# EAGLE design ControllerBoard (EAGLE 9.6.2)
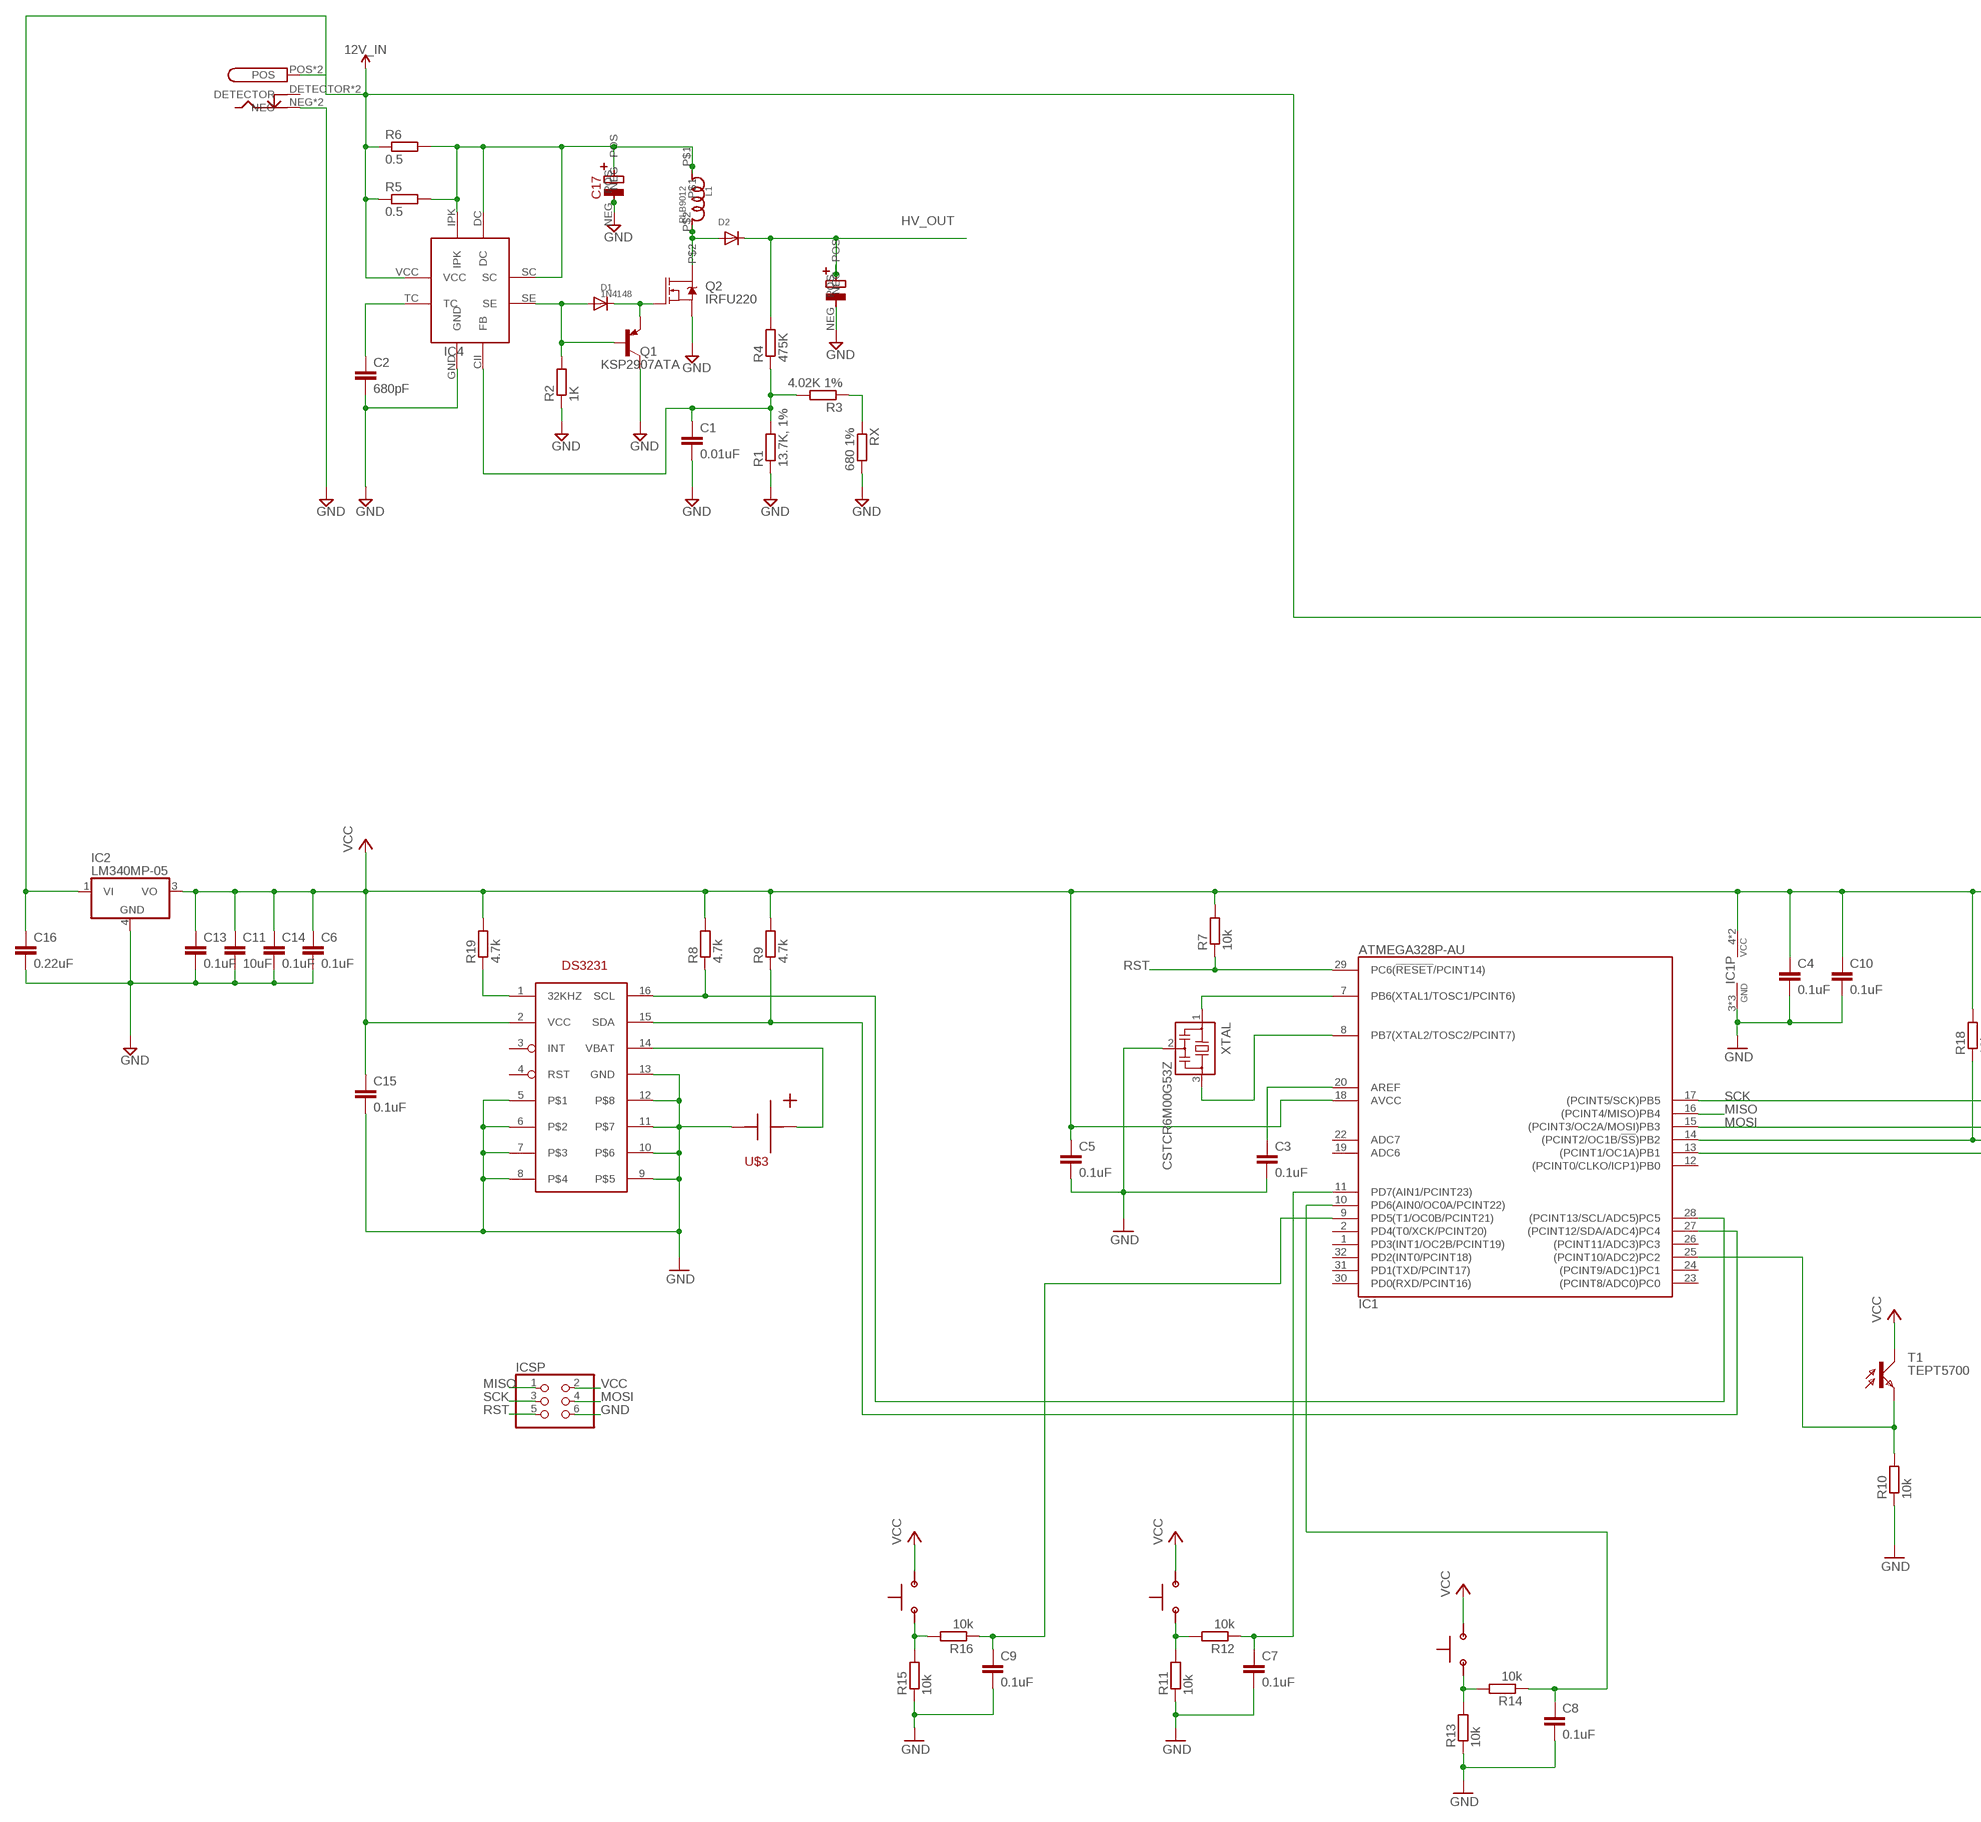
[diagram p0: schematic, sheet 1, part 1 of 2]
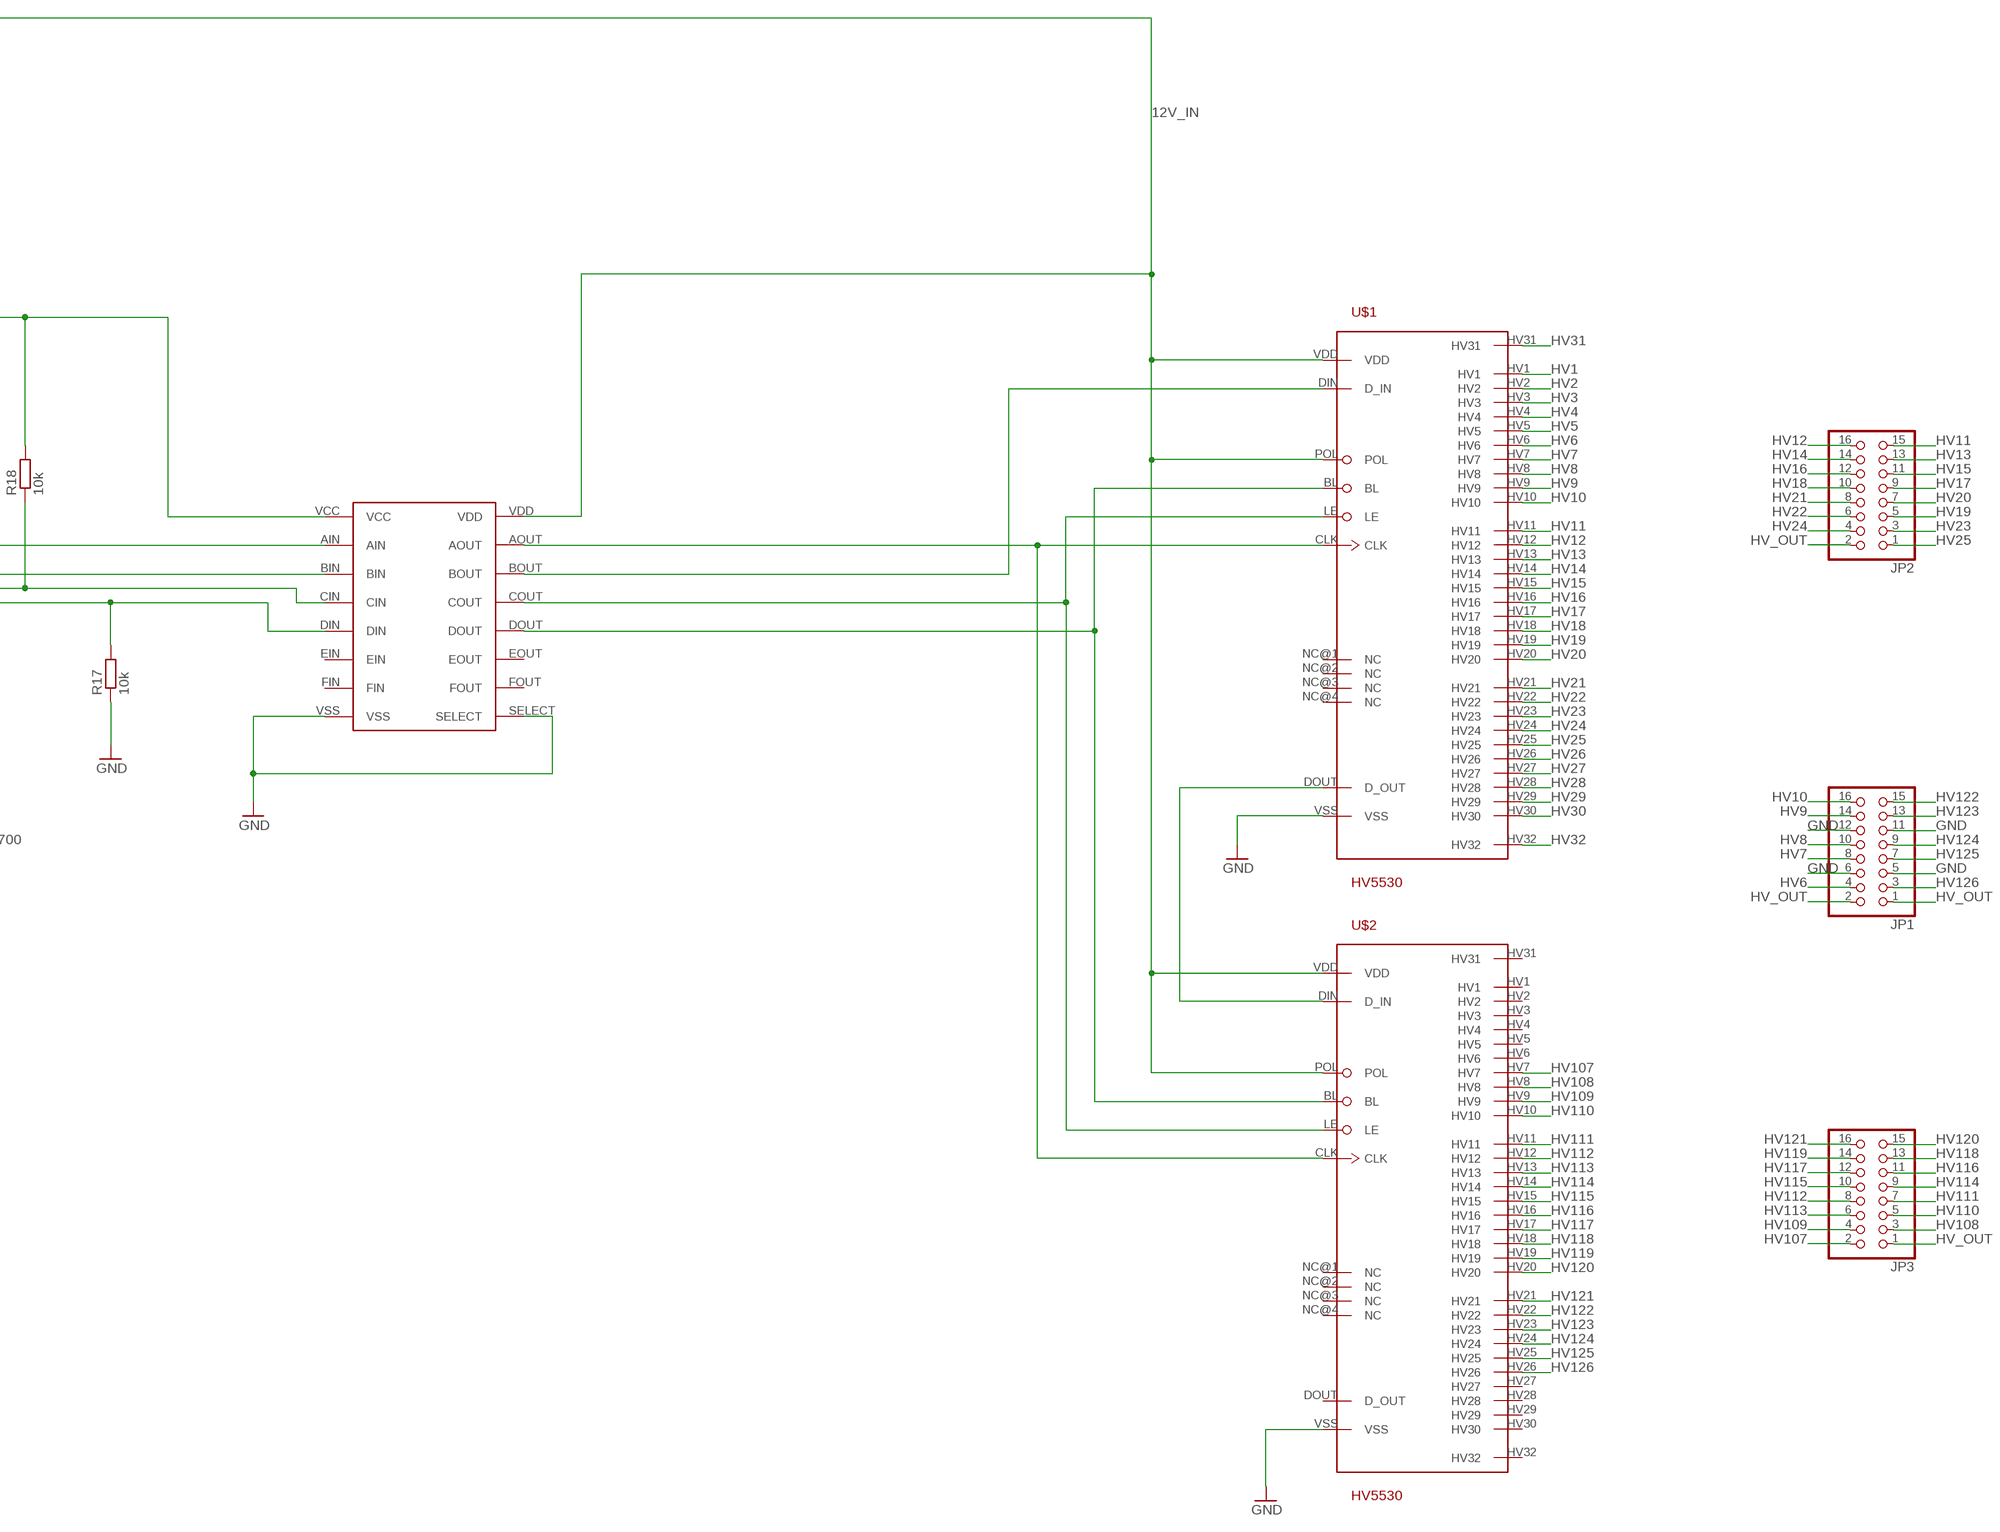
[diagram p1: schematic, sheet 1, part 2 of 2]

## Parts
12V  CUI_PWR_JACK  [CUI_PWR_JACK]
C1  0.01uF  C-EUC0603  [C0603]
C2  680pF  C-EUC0603  [C0603]
C3  0.1uF  C-EUC0603  [C0603]
C4  0.1uF  C-EUC0603  [C0603]
C5  0.1uF  C-EUC0603  [C0603]
C6  0.1uF  C-EUC0603  [C0603]
C7  0.1uF  C-EUC0603  [C0603]
C8  0.1uF  C-EUC0603  [C0603]
C9  0.1uF  C-EUC0603  [C0603]
C10  0.1uF  C-EUC0603  [C0603]
C11  10uF  C-EUC0603  [C0603]
C12  ECA-2DM3R3  [ECA-2DM3R3]
C13  0.1uF  C-EUC0603  [C0603]
C14  0.1uF  C-EUC0603  [C0603]
C15  0.1uF  C-EUC0603  [C0603]
C16  0.22uF  C-EUC0603  [C0603]
C17  EEU-FM1  [EEU-FM1]
D1  1N4148  DIODESOD-123  [SOD-123]
D2  DIODESOD-123  [SOD-123]
IC1  ATMEGA328P-AU  [QFP32_7X7_0.80]
IC2  LM340MP-05  [SOT223]
IC3  CD4504BTSSOP16  [SOP65P640X120-16N]
IC4  MC34063  MC34063ADR  [SOIC127P600X175-8]
ICSP  PINHD-2X3  [2X03]
JP1  PINHD-2X8  [2X08]
JP2  PINHD-2X8  [2X08]
JP3  PINHD-2X8  [2X08]
L1  RLB9012  [RLB9012]
Q1  KSP2907ATA  2N2907  [TO92-EBC-OVAL]
Q2  IRFU220  MOSFET-NCH-FQP30N06L  [TO220V]
R1  13.7K, 1%  R-EU_R1206  [R1206]
R2  1K  R-EU_R1206  [R1206]
R3  4.02K 1%  R-EU_R1206  [R1206]
R4  475K  R-EU_R1206  [R1206]
R5  0.5  R-EU_R1206  [R1206]
R6  0.5  R-EU_R1206  [R1206]
R7  10k  R-EU_R0603  [R0603]
R8  4.7k  R-EU_R0603  [R0603]
R9  4.7k  R-EU_R0603  [R0603]
R10  10k  R-EU_R0603  [R0603]
R11  10k  R-EU_R0603  [R0603]
R12  10k  R-EU_R0603  [R0603]
R13  10k  R-EU_R0603  [R0603]
R14  10k  R-EU_R0603  [R0603]
R15  10k  R-EU_R0603  [R0603]
R16  10k  R-EU_R0603  [R0603]
R17  10k  R-EU_R0603  [R0603]
R18  10k  R-EU_R0603  [R0603]
R19  4.7k  R-EU_R0603  [R0603]
RTC  DS3231  [SO16]
RX  680 1%  R-EU_R1206  [R1206]
S1  TL1105  [TL1105]
S2  TL1105  [TL1105]
S3  TL1105  [TL1105]
T1  TEPT5700  BPX81  [BPX81]
U$1  HV5530  [44_PQFP_CORRECTED]
U$2  HV5530  [44_PQFP_CORRECTED]
U$3  CR2032-SMD-HLDR  [CR2032-SMD]
XTAL  CSTCR6M00G53Z  [CSTCR6M]

## Nets
12V_IN: 12V.POS 12V.POS1(POS) C16.1 IC2.1(VI) IC3.VDD IC4.VCC R5.1 R6.1 U$1.POL U$1.VDD U$2.POL U$2.VDD
GND: 12V.NEG 12V.NEG1(NEG) C1.2 C2.2 C3.2 C4.2 C5.2 C6.2 C7.2 C8.2 C9.2 C10.2 C11.2 C12.NEG C13.2 C14.2 C15.2 C16.2 C17.NEG IC1.3(GND) IC1.5(GND) IC1.21(GND) IC2.4(GND) IC3.SELECT IC3.VSS IC4.GND ICSP.6 JP1.5 JP1.6 JP1.11 JP1.12 Q1.C Q2.3(S) R1.1 R2.1 R10.1 R11.1 R13.1 R15.1 R17.1 RTC.5 RTC.6 RTC.7 RTC.8 RTC.9 RTC.10 RTC.11 RTC.12 RTC.13(GND) RX.2 U$1.VSS U$2.VSS U$3.NEG XTAL.2
HV1: U$1.HV1
HV2: U$1.HV2
HV3: U$1.HV3
HV4: U$1.HV4
HV5: U$1.HV5
HV6: JP1.4 U$1.HV6
HV7: JP1.8 U$1.HV7
HV8: JP1.10 U$1.HV8
HV9: JP1.14 U$1.HV9
HV10: JP1.16 U$1.HV10
HV11: JP2.15 U$1.HV11
HV12: JP2.16 U$1.HV12
HV13: JP2.13 U$1.HV13
HV14: JP2.14 U$1.HV14
HV15: JP2.11 U$1.HV15
HV16: JP2.12 U$1.HV16
HV17: JP2.9 U$1.HV17
HV18: JP2.10 U$1.HV18
HV19: JP2.5 U$1.HV19
HV20: JP2.7 U$1.HV20
HV21: JP2.8 U$1.HV21
HV22: JP2.6 U$1.HV22
HV23: JP2.3 U$1.HV23
HV24: JP2.4 U$1.HV24
HV25: JP2.1 U$1.HV25
HV26: U$1.HV26
HV27: U$1.HV27
HV28: U$1.HV28
HV29: U$1.HV29
HV30: U$1.HV30
HV31: U$1.HV31
HV32: U$1.HV32
HV107: JP3.2 U$2.HV7
HV108: JP3.3 U$2.HV8
HV109: JP3.4 U$2.HV9
HV110: JP3.5 U$2.HV10
HV111: JP3.7 U$2.HV11
HV112: JP3.8 U$2.HV12
HV113: JP3.6 U$2.HV13
HV114: JP3.9 U$2.HV14
HV115: JP3.10 U$2.HV15
HV116: JP3.11 U$2.HV16
HV117: JP3.12 U$2.HV17
HV118: JP3.13 U$2.HV18
HV119: JP3.14 U$2.HV19
HV120: JP3.15 U$2.HV20
HV121: JP3.16 U$2.HV21
HV122: JP1.15 U$2.HV22
HV123: JP1.13 U$2.HV23
HV124: JP1.9 U$2.HV24
HV125: JP1.7 U$2.HV25
HV126: JP1.3 U$2.HV26
HV_OUT [wide keepout]: C12.POS D2.C JP1.1 JP1.2 JP2.2 JP3.1 R4.2
MISO: IC1.16((PCINT4/MISO)PB4) ICSP.1
MOSI: IC1.15((PCINT3/OC2A/MOSI)PB3) IC3.BIN ICSP.4
N$1: RTC.14(VBAT) U$3.POS@1(POS) U$3.POS@2(POS)
N$2: IC1.7(PB6(XTAL1/TOSC1/PCINT6)) XTAL.1
N$3: IC1.8(PB7(XTAL2/TOSC2/PCINT7)) XTAL.3
N$4: R19.1 RTC.1(32KHZ)
N$5: IC3.AOUT U$1.CLK U$2.CLK
N$6: U$1.DOUT(D_OUT) U$2.DIN(D_IN)
N$7: IC3.BOUT U$1.DIN(D_IN)
N$8: C17.POS IC4.DC IC4.IPK IC4.SC L1.P$1 R5.2 R6.2
N$9: C2.1 IC4.TC
N$10: D1.A IC4.SE Q1.B R2.2
N$11: D1.C Q1.E Q2.1(G)
N$12 [wide keepout]: D2.A L1.P$2 Q2.2(D)
N$13: C1.1 IC4.CII(FB) R1.2 R3.2 R4.1
N$14: IC1.14((PCINT2/OC1B/!SS!)PB2) IC3.CIN R18.1
N$15: IC1.13((PCINT1/OC1A)PB1) IC3.DIN R17.2
N$16: IC3.COUT U$1.LE U$2.LE
N$17: IC3.DOUT U$1.BL U$2.BL
N$18: C3.1 IC1.20(AREF)
N$19: IC1.25((PCINT10/ADC2)PC2) R10.2 T1.E
N$20: R3.1 RX.1
N$21: R13.2 R14.2 S2.1 S2.2
N$22: R11.2 R12.2 S1.1 S1.2
N$23: C8.1 IC1.10(PD6(AIN0/OC0A/PCINT22)) R14.1
N$24: C7.1 IC1.11(PD7(AIN1/PCINT23)) R12.1
N$25: R15.2 R16.2 S3.1 S3.2
N$26: C9.1 IC1.9(PD5(T1/OC0B/PCINT21)) R16.1
RST: IC1.29(PC6(!RESET!/PCINT14)) ICSP.5 R7.1
SCK: IC1.17((PCINT5/SCK)PB5) IC3.AIN ICSP.3
SCL: IC1.28((PCINT13/SCL/ADC5)PC5) R8.1 RTC.16(SCL)
SDA: IC1.27((PCINT12/SDA/ADC4)PC4) R9.1 RTC.15(SDA)
VCC: C4.1 C5.1 C6.1 C10.1 C11.1 C13.1 C14.1 C15.1 IC1.4(VCC) IC1.6(VCC) IC1.18(AVCC) IC2.3(VO) IC3.VCC ICSP.2 R7.2 R8.2 R9.2 R18.2 R19.2 RTC.2(VCC) S1.3 S1.4 S2.3 S2.4 S3.3 S3.4 T1.C
Unconnected: 12V.DETECTOR 12V.DETECTOR1(DETECTOR) IC1.1(PD3(INT1/OC2B/PCINT19)) IC1.2(PD4(T0/XCK/PCINT20)) IC1.12((PCINT0/CLKO/ICP1)PB0) IC1.19(ADC6) IC1.22(ADC7) IC1.23((PCINT8/ADC0)PC0) IC1.24((PCINT9/ADC1)PC1) IC1.26((PCINT11/ADC3)PC3) IC1.30(PD0(RXD/PCINT16)) IC1.31(PD1(TXD/PCINT17)) IC1.32(PD2(INT0/PCINT18)) IC3.EIN IC3.EOUT IC3.FIN IC3.FOUT RTC.3(INT) RTC.4(RST) U$1.NC@1(NC) U$1.NC@2(NC) U$1.NC@3(NC) U$1.NC@4(NC) U$2.DOUT(D_OUT) U$2.HV1 U$2.HV2 U$2.HV3 U$2.HV4 U$2.HV5 U$2.HV6 U$2.HV27 U$2.HV28 U$2.HV29 U$2.HV30 U$2.HV31 U$2.HV32 U$2.NC@1(NC) U$2.NC@2(NC) U$2.NC@3(NC) U$2.NC@4(NC)

## Library data of the parts
12V = CUI_PWR_JACK:CUI_PWR_JACK
C1-C11 C13-C16 = rcl:C-EU: CAPACITOR, European symbol; SPICEPREFIX: C
C12 = HCAPS:ECA-2DM3R3
C17 = HCAPS:EEU-FM1
D1 D2 = adafruit:DIODE: Diode SMADIODE - SMA Surface Mount Package 20V 1A Schottky Diode Digikey: 641-1014-6-ND DO-1N4148 - Through Hole Small Current Diode SOD-123 20V 1 A (.5mV Vf) Schottky Diode - Digikey: MBRX120TPMSCT-ND SOD-323 10V 570mA (.38mV Vf, 3ns) Schottky Diode - Digikey: ZLLS410CT-ND SOD-523 30V 30mA Schottky Diode (RB751S-40TE61) - Digikey: RB751S-40TE61CT-ND SOT23-R/W - SOT23 Package (R = Solder Paste/Reflow Ovens, W = Hand-Soldering) BAT54Film 40V 300mA - Digikey: 497-7162-1-ND
IC1 = atmel:ATMEGA*8: 8-bit AVR Microcontroller 4/8/16/32 kbytes flash 512/1k/1k/2k bytes SRAM 256/512/512/1k bytes EEPROM USART, 6/8-channel 10 bit ADC Pin compatible with Atmega8(L,A) Note: ADC6 and ADC7 are not available in 28-lead packages
IC2 = linear:LM340?-*: Positive VOLTAGE REGULATOR Source: http://cache.national.com/ds/LM/LM340.pdf
IC3 = CD4504B:CD4504B
IC4 = NixiePSU-Lib:MC34063
ICSP = pinhead:PINHD-2X3: PIN HEADER
JP1-JP3 = pinhead:PINHD-2X8: PIN HEADER
L1 = RLB9012:RLB9012
Q1 = adafruit:2N2907*: PNP Transistor Big Oval pads
Q2 = SparkFun-DiscreteSemi:MOSFET-NCH: N-channel MOSFETs Voltage controlled devices that allow control of high current outputs. SparkFun Products: SparkFun OpenScale <https://www.sparkfun.com/products/13261> SparkFun Digital Sandbox <https://www.sparkfun.com/products/12651> SparkFun Monster Moto Shield <https://www.sparkfun.com/products/10182> SparkFun MOSFET Power Controller <https://www.sparkfun.com/products/11214>; PROD_ID: TRANS-10060; VALUE: 60V/32A/35mΩ
R1-R19 RX = rcl:R-EU_: RESISTOR, European symbol; SPICEPREFIX: R
RTC = DS3231:DS3231
S1-S3 = TL1105:TL1105
T1 = opto-trans-siemens:BPX81: PHOTO TRANSISTOR; OC_FARNELL: unknown; OC_NEWARK: unknown
U$1 U$2 = HV5530:HV5530
U$3 = CR2032:CR2032-SMD-HLDR
XTAL = murata-filter:CSTCR: Resonator Source: murata.co.jp; MPN: CSTCR6M00G53-R0; OC_FARNELL: 1170434; OC_NEWARK: 25M8759

## Net classes
1 wide keepout: clearance 1.016 mm

## Board
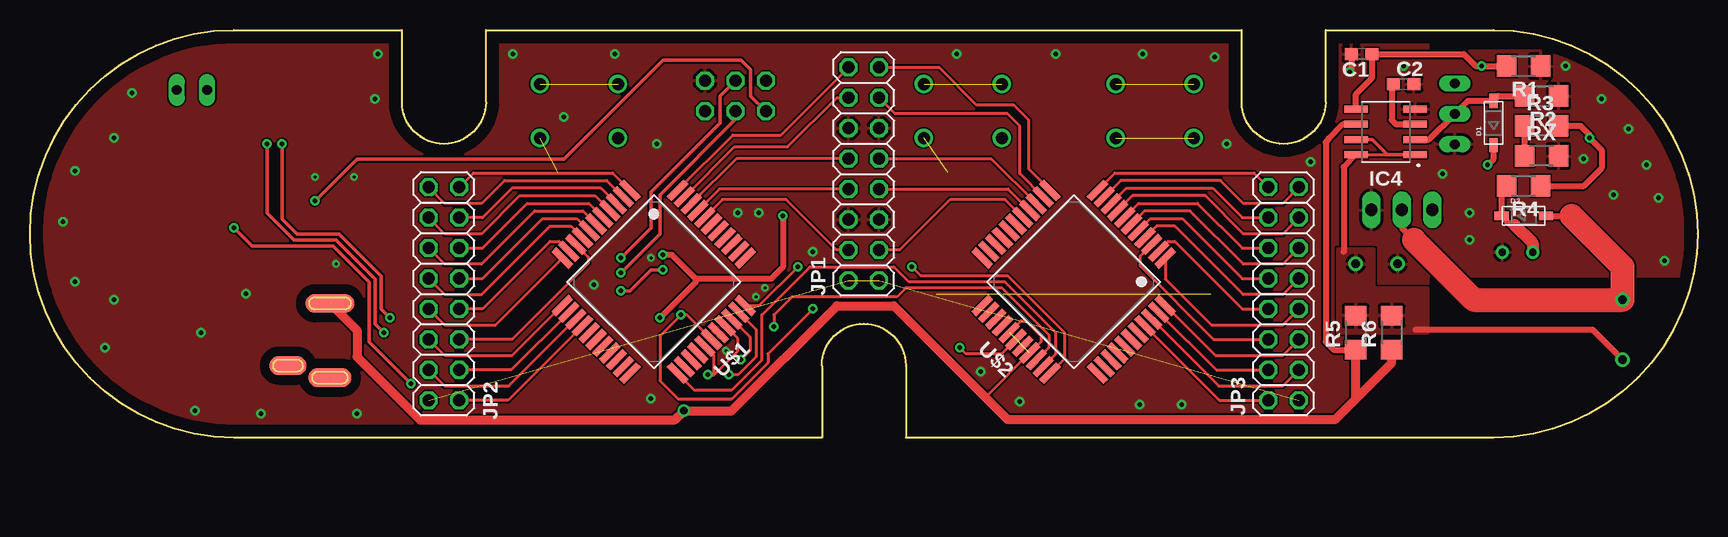
[diagram p2: board, top side]
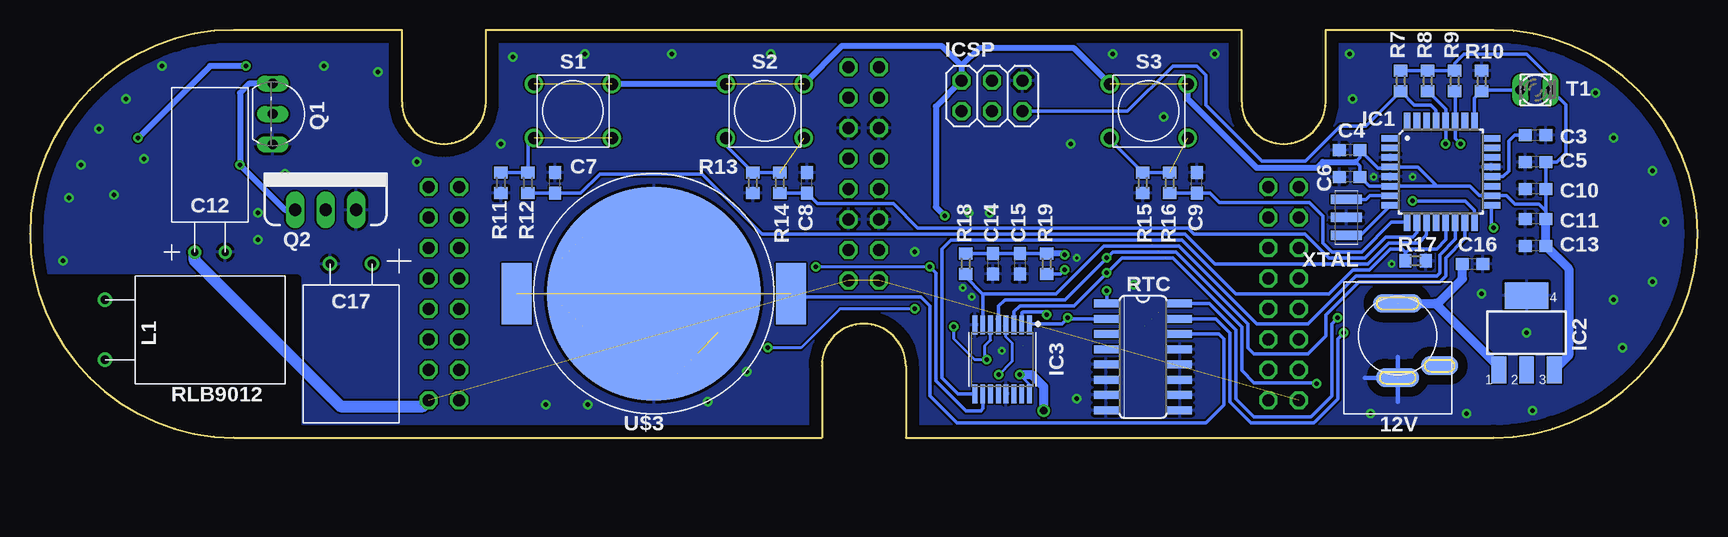
[diagram p3: board, bottom side, seen from below]

Size 139 x 34 mm. Coordinates in mm from the lower left corner, seen from the top.
Outline: 122,34 arc-180 122,0 73,0 73,6 arc180 66,6 66,0 17,0 arc-180 17,34 31,34 31,28 arc180 38,28 38,34 101,34 101,28 arc180 108,28 108,34 122,34
Copper layers (1*16): Top 0.035mm / dielectric 1.5mm / Bottom 0.035mm
Design rules "default *": minimum track width 6mil, minimum drill 0.2mm, track to track 6mil, track to pad 6mil, pad to pad 6mil, via to via 6mil, smd to smd 6mil, copper to edge 40mil, drill to drill 6mil, minimum pad ring 10mil, minimum via ring 8mil, stop-mask expansion 4mil, vias tented up to drill 0mil, thermal gap 10mil
bRestrict: area 116.8,-0.5 to 139.5,13.2

### Footprints (pad centres in the part's own frame; a part is rotated, then mirrored left to right if it is on the bottom)
CUI_PWR_JACK = smd 3.048 x 1.524: DETECTOR 3.5,-2.5 | smd 3.048 x 1.524 bottom: DETECTOR1 3.5,-2.5 | smd 3.556 x 1.524: NEG 0,-3.5 | smd 3.556 x 1.524 bottom: NEG1 0,-3.5 | smd 4.064 x 1.524: POS 0,2.7 | smd 4.064 x 1.524 bottom: POS1 0,2.7
C0603 = smd 1.1 x 1: 1 -0.85,0; 2 0.85,0
ECA-2DM3R3 = drill 0.6: NEG -2.54,-1.27; POS -2.54,1.27
EEU-FM1 = drill 0.7: NEG -1.75,-1.75; POS -1.75,1.75
SOD-123 = smd 1.2 x 0.7: A 1.85,0; C -1.85,0
QFP32_7X7_0.80 = smd 1.5 x 0.55: 1 -4.2,2.8; 2 -4.2,2; 3 -4.2,1.2; 4 -4.2,0.4; 5 -4.2,-0.4; 6 -4.2,-1.2; 7 -4.2,-2; 8 -4.2,-2.8; 17 4.2,-2.8; 18 4.2,-2; 19 4.2,-1.2; 20 4.2,-0.4; 21 4.2,0.4; 22 4.2,1.2; 23 4.2,2; 24 4.2,2.8 | smd 0.55 x 1.5: 9 -2.8,-4.2; 10 -2,-4.2; 11 -1.2,-4.2; 12 -0.4,-4.2; 13 0.4,-4.2; 14 1.2,-4.2; 15 2,-4.2; 16 2.8,-4.2; 25 2.8,4.2; 26 2,4.2; 27 1.2,4.2; 28 0.4,4.2; 29 -0.4,4.2; 30 -1.2,4.2; 31 -2,4.2; 32 -2.8,4.2
SOT223 = smd 1.219 x 2.235: 1 -2.311,-3.099; 2 0,-3.099; 3 2.311,-3.099 | smd 3.6 x 2.2: 4 0,3.099
SOP65P640X120-16N = smd 1.572 x 0.407: AIN -2.872,0.975; AOUT -2.872,1.625; BIN -2.872,-0.325; BOUT -2.872,0.325; CIN -2.872,-1.625; COUT -2.872,-0.975; DIN 2.872,-2.275; DOUT 2.872,-1.625; EIN 2.872,-0.975; EOUT 2.872,-0.325; FIN 2.872,0.975; FOUT 2.872,1.625; SELECT 2.872,0.325; VCC -2.872,2.275; VDD 2.872,2.275; VSS -2.872,-2.275
SOIC127P600X175-8 = smd 1.968 x 0.599: CII 2.473,-1.905; DC 2.473,1.905; GND -2.473,-1.905; IPK 2.473,0.635; SC -2.473,1.905; SE -2.473,0.635; TC -2.473,-0.635; VCC 2.473,-0.635
2X03 = drill 1.016 octagon: 1 -2.54,-1.27; 2 -2.54,1.27; 3 0,-1.27; 4 0,1.27; 5 2.54,-1.27; 6 2.54,1.27
2X08 = drill 1.016 octagon: 1 -8.89,-1.27; 2 -8.89,1.27; 3 -6.35,-1.27; 4 -6.35,1.27; 5 -3.81,-1.27; 6 -3.81,1.27; 7 -1.27,-1.27; 8 -1.27,1.27; 9 1.27,-1.27; 10 1.27,1.27; 11 3.81,-1.27; 12 3.81,1.27; 13 6.35,-1.27; 14 6.35,1.27; 15 8.89,-1.27; 16 8.89,1.27
RLB9012 = drill 0.7: P$1 -2.5,-2.5; P$2 -2.5,2.5
TO92-EBC-OVAL = drill 0.813 long: B 0,-1.27; C 2.54,-1.27; E -2.54,-1.27
TO220V = drill 1.016 long: 1 -2.54,0; 2 0,0; 3 2.54,0
R1206 = smd 1.6 x 1.803: 1 -1.422,0; 2 1.422,0
R0603 = smd 1 x 1.1: 1 -0.85,0; 2 0.85,0
SO16 = smd 0.66 x 2.032: 1 -4.445,-3.073; 2 -3.175,-3.073; 3 -1.905,-3.073; 4 -0.635,-3.073; 5 0.635,-3.073; 6 1.905,-3.073; 7 3.175,-3.073; 8 4.445,-3.073; 9 4.445,3.073; 10 3.175,3.073; 11 1.905,3.073; 12 0.635,3.073; 13 -0.635,3.073; 14 -1.905,3.073; 15 -3.175,3.073; 16 -4.445,3.073
TL1105 = drill 1: 1 0,0; 2 6.5,0; 3 0,4.5; 4 6.5,4.5
BPX81 = drill 0.813 long: C 1.27,0; E -1.27,0
44_PQFP_CORRECTED = smd 0.55 x 2: BL -4,6.8; CLK 0,6.8; DIN -3.2,6.8; DOUT 4,6.8; HV11 -4,-6.8; HV12 -3.2,-6.8; HV13 -2.4,-6.8; HV14 -1.6,-6.8; HV15 -0.8,-6.8; HV16 0,-6.8; HV17 0.8,-6.8; HV18 1.6,-6.8; HV19 2.4,-6.8; HV20 3.2,-6.8; HV21 4,-6.8; LE -2.4,6.8; NC@1 3.2,6.8; NC@2 2.4,6.8; NC@3 1.6,6.8; POL 0.8,6.8; VDD -1.6,6.8; VSS -0.8,6.8 | smd 2 x 0.55: HV1 -6.8,3.2; HV2 -6.8,2.4; HV3 -6.8,1.6; HV4 -6.8,0.8; HV5 -6.8,0; HV6 -6.8,-0.8; HV7 -6.8,-1.6; HV8 -6.8,-2.4; HV9 -6.8,-3.2; HV10 -6.8,-4; HV22 6.8,-4; HV23 6.8,-3.2; HV24 6.8,-2.4; HV25 6.8,-1.6; HV26 6.8,-0.8; HV27 6.8,0; HV28 6.8,0.8; HV29 6.8,1.6; HV30 6.8,2.4; HV31 6.8,3.2; HV32 6.8,4; NC@4 -6.8,4
CR2032-SMD = smd 17.8 x 17.8: NEG 0,0 | smd 2.5 x 5.1: POS@1 -11.45,0; POS@2 11.45,0
CSTCR6M = smd 0.8 x 2.6: 1 -1.5,0; 2 0,0; 3 1.5,0

### Placement (x,y rotation side)
12V  25,8.5 0 bottom
C1  111,32 180 top
C2  114.5,29.5 0 top
C3  13.5,25.25 0 bottom
C4  29,24 180 bottom
C5  13.5,23 180 bottom
C6  29,21.75 180 bottom
C7  95.25,21.25 90 bottom
C8  74.25,21.25 90 bottom
C9  41.75,21.25 90 bottom
C10  13.5,20.75 180 bottom
C11  13.5,18.25 180 bottom
C12  124,18 90 bottom
C13  13.5,16 180 bottom
C14  58.75,14.5 270 bottom
C15  56.5,14.5 270 bottom
C16  18.75,14.5 0 bottom
C17  112.25,12.75 270 bottom
D1  122,26.25 90 top
D2  124.5,18.5 0 top
IC1  21.4,22.18 0 bottom
IC2  14.25,8.75 0 bottom
IC3  57.96,6.52 270 bottom
IC4  113,25.5 180 top
ICSP  58.81,28.5 0 bottom
JP1  69.5,22 90 top
JP2  34.5,12 90 top
JP3  104.5,12 90 top
L1  130.25,9 0 bottom
Q1  117.5,27 270 bottom
Q2  114.36,18.99 0 bottom
R1  124.5,31 180 top
R2  126,28.5 180 top
R3  126,26 0 top
R4  124.5,21 180 top
R5  110.5,8.75 90 top
R6  113.5,8.75 90 top
R7  24.75,29.75 90 bottom
R8  22.5,29.75 90 bottom
R9  20.25,29.75 90 bottom
R10  18,29.75 270 bottom
R11  99.75,21.25 90 bottom
R12  97.5,21.25 90 bottom
R13  78.75,21.25 90 bottom
R14  76.5,21.25 90 bottom
R15  46.25,21.25 90 bottom
R16  44,21.25 90 bottom
R17  23.5,14.75 180 bottom
R18  61,14.5 90 bottom
R19  54.25,14.5 90 bottom
RTC  46.23,6.72 270 bottom
RX  126,23.5 0 top
S1  97,25 0 bottom
S2  81,25 0 bottom
S3  49,25 0 bottom
T1  13.5,29 0 bottom
U$1  52,13 225 top
U$2  87,13 135 top
U$3  87,12 0 bottom
XTAL  29.27,18.36 270 bottom

### Tracks (layer width: path | path; a pad name or v marks a point on that pad's centre or on a via)
12V_IN  (via drill 0.35, 0.6)  (5 unrouted)
  Top 0.254: v56.5,5.25 57,5.25 | 57,5.25 57,6.87 U$1.POL | 57,5.25 59,7.25 59,8.26 U$1.VDD | 79.62,3.38 79.64,3.38 U$2.VDD 84.25,7.99 84.25,8.5 83,9.75 82.62,9.75 U$2.POL
  Top 0.508: IC4.VCC 109.45,26.14 108.26,24.94 108,24.63 108,8 108.67,7.33 R5.1
  Top 0.762: 12V.POS1 27.25,8.95 27.25,6.75 32.53,1.47 53.72,1.47 v54.5,2.25 54.53,2.22 58.47,2.22 67.25,11 72,11 79.62,3.38 81.5,1.5 108.75,1.5 110.5,3.25 | 110.5,3.25 R5.1 | 110.5,3.25 113.5,6.25 R6.1
  Bottom 0.254: IC3.VDD 55.68,4.43 v56.5,5.25
  Bottom 0.762: 12V.POS1 21.86,11.2 | 21.86,11.2 21.65,11.2 19.6,13.25 C16.1 | 21.86,11.2 16.56,5.9 IC2.1 | v54.5,2.25 54.5,4.25 55.5,5.25 v56.5,5.25
GND  (via drill 0.25, 0.35)  (1 unrouted)
  Top 0.508: C1.2 110.15,30.65 v110,30.5
  Bottom 0.381: 12V.NEG1 25,6.75 | 12V.NEG1 25,3 | 27.75,5 12V.NEG1
  other vias: 114.5,31 128,31 131,28.25 129.5,23.25 79.25,5.5 58,7.25 60.5,11.75 61.25,12.5 23.75,21.75 27,21.75 51.75,3.25 47,12.75 59,18.75 60.75,18.75 51.75,15 25.5,14.5 7,25 7,11.5 14.25,8.75 18,12 52.25,24.5 65.25,15.5 133.25,25.75 134.75,22.75 135.75,20 136.25,14.75 106.75,23 99.75,24.5 98.75,31.75 92.75,32 85.5,32 77.25,32 48.75,32 40.25,32 29,32 28.75,28.25 44.5,26.75 8.5,28.75 3.75,22.25 2.75,18 3.75,13 6.25,7.5 13.75,2.25 19.25,2 27.25,2 82.5,3 92.5,2.75 96,2.75 132,20.25 120,16.5 120,18.75 117.75,22
  pour Bottom: 0,34 0,0 139,0 139,34
  pour Top: 137.75,32.25 112.5,32.25 112.5,22.5 109.5,22.5 109.5,16.75 113,16.75 113,13.5 137.75,13.5
  pour Top (rank 2): 0.25,33.25 116.5,33.25 116.5,0.75 0,0.75
HV6
  Top 0.254: JP1.4 67.25,15.65 63.04,19.86 57.73,19.86 U$1.HV6
HV7
  Top 0.254: JP1.8 57.47,20.73 U$1.HV7
HV8
  Top 0.254: JP1.10 58.88,23.27 U$1.HV8
HV9
  Top 0.254: U$1.HV9 58.74,24.26 63.16,24.26 67.25,28.35 JP1.14
HV10
  Top 0.254: U$1.HV10 58.59,25.25 62.61,25.25 68.23,30.87 JP1.16
HV11
  Top 0.254: JP2.15 36.96,22.08 48.58,22.08 U$1.HV11
HV12
  Top 0.254: U$1.HV12 48.08,21.45 39.54,21.45 37.64,19.54 34.58,19.54 JP2.16
HV13
  Top 0.254: U$1.HV13 47.58,20.81 40.18,20.81 37.72,18.35 JP2.13
HV14
  Top 0.254: U$1.HV14 47.09,20.18 40.81,20.18 37.64,17 34.58,17 JP2.14
HV15
  Top 0.254: JP2.11 37.72,15.81 41.45,19.54 46.59,19.54 U$1.HV15
HV16
  Top 0.254: U$1.HV16 46.09,18.91 42.08,18.91 37.64,14.46 34.58,14.46 JP2.12
HV17
  Top 0.254: JP2.9 37.72,13.27 42.72,18.27 45.6,18.27 U$1.HV17
HV18  (1 unrouted)
  Top 0.254: JP2.10 34.58,11.92 37.64,11.92 43.35,17.64 45.1,17.64 U$1.HV18
HV19  (1 unrouted)
  Top 0.254: U$1.HV19 46.53,15.08 46.53,14.53 40.19,8.19 JP2.5
HV20  (1 unrouted)
  Top 0.254: U$1.HV20 44.11,16.36 43.35,16.36 37.72,10.73 JP2.7
HV21  (1 unrouted)
  Top 0.254: U$1.HV21 44.36,14.94 38.79,9.37 34.59,9.37 JP2.8
HV22  (1 unrouted)
  Top 0.254: JP2.6 34.58,6.84 40.18,6.84 U$1.HV22
HV23  (1 unrouted)
  Top 0.254: JP2.3 40.12,5.65 U$1.HV23
HV24  (1 unrouted)
  Top 0.254: JP2.4 34.58,4.3 39.91,4.3 U$1.HV24
HV25  (1 unrouted)
  Top 0.254: U$1.HV25 39.85,3.11 JP2.1
HV107  (1 unrouted)
  Top 0.254: U$2.HV7 99.15,3.11 JP3.2
HV108  (1 unrouted)
  Top 0.254: U$2.HV8 99.09,4.3 104.42,4.3 JP3.3
HV109  (1 unrouted)
  Top 0.254: U$2.HV9 98.88,5.65 JP3.4
HV110  (1 unrouted)
  Top 0.254: U$2.HV10 98.82,6.84 104.42,6.84 JP3.5
HV111  (1 unrouted)
  Top 0.254: U$2.HV11 94.64,13.23 98.48,9.38 104.42,9.38 JP3.7
HV112  (1 unrouted)
  Top 0.254: U$2.HV12 94.89,16.36 95.42,16.36 101.06,10.73 JP3.8
HV113  (1 unrouted)
  Top 0.254: JP3.6 98.65,8.19 92.55,14.3 92.55,15.15 U$2.HV13
HV114  (1 unrouted)
  Top 0.254: JP3.9 104.42,11.92 101.14,11.92 95.42,17.64 93.9,17.64 U$2.HV14
HV115
  Top 0.254: U$2.HV15 93.4,18.27 96.06,18.27 101.06,13.27 JP3.10
HV116
  Top 0.254: JP3.11 104.42,14.46 101.14,14.46 96.69,18.91 92.91,18.91 U$2.HV16
HV117
  Top 0.254: U$2.HV17 92.41,19.54 97.33,19.54 101.06,15.81 JP3.12
HV118
  Top 0.254: JP3.13 104.42,17 101.14,17 97.96,20.18 91.91,20.18 U$2.HV18
HV119
  Top 0.254: U$2.HV19 91.42,20.81 98.6,20.81 101.06,18.35 JP3.14
HV120
  Top 0.254: JP3.15 104.42,19.54 101.14,19.54 99.23,21.45 90.92,21.45 U$2.HV20
HV121
  Top 0.254: U$2.HV21 90.42,22.08 102.04,22.08 JP3.16
HV122
  Top 0.254: JP1.15 75.77,30.89 78.91,27.75 82,27.75 83.25,26.5 83.25,22.41 U$2.HV22
HV123
  Top 0.254: JP1.13 72.11,27.01 81.49,27.01 82.51,25.99 82.51,22.01 U$2.HV23
HV124
  Top 0.254: JP1.9 80.12,23.27 U$2.HV24
HV125
  Top 0.254: JP1.7 81.53,20.73 U$2.HV25
HV126
  Top 0.254: U$2.HV26 81.27,19.86 76.69,19.86 72.48,15.65 JP1.3
HV_OUT  (3 unrouted)
  Top 0.508: R4.2 122.65,20.57 D2.C 123.4,17.75 123.73,17.75
  Top 1: 123.73,17.75 125.27,16.21 C12.POS
  Bottom 1: JP3.1 106.27,2.61 113.11,2.61 125.27,14.77 C12.POS
MISO  (via drill 0.35)
  Top 0.305: v23.75,19.75 27.25,23.25 44.5,23.25 52.75,31.5 59.25,31.5 60.08,30.67 60.08,28.5 ICSP.1
  Bottom 0.305: IC1.16 18.6,18.98 19.35,19.73 23.73,19.73 v23.75,19.75
MOSI  (via drill 0.35)
  Top 0.305: ICSP.4 57.5,28.46 57.5,26.25 51.75,20.5 51.75,17.5 v49.25,15
  Bottom 0.305: IC1.15 19.4,16.6 21,15 21,13.5 21.5,13 28.25,13 31,10.25 31,8.5 32.5,7 37,7 37.5,7.5 37.5,9.5 43.5,15.5 48.75,15.5 v49.25,15 52.75,11.5 57.75,11.5 58.28,10.97 IC3.BIN
N$1  (1 unrouted)
  Bottom 0.305: U$3.POS@2 75.3,11.75 64.75,11.75 64,11 64,3.5 61.74,1.25 41,1.25 39.5,2.75 39.5,8.25 39.88,8.63 RTC.14
N$2
  Bottom 0.305: XTAL.1 27.64,19.86 27.32,20.18 IC1.7
N$3
  Bottom 0.305: XTAL.3 28.11,16.86 IC1.8
N$4  (via drill 0.35)
  Top 0.305: v49.25,12.25 50,12.25 51.75,14 v52.75,14
  Bottom 0.305: RTC.1 49.25,11.22 v49.25,12.25 | R19.1 53.1,13.65 v52.75,14
N$5  (via drill 0.35)  (2 unrouted)
  Top 0.254: U$1.CLK 54.75,10.25 v54.25,10.25 52.5,8.5 52.5,4.75 54,3.25 58.5,3.25 61.5,6.25 61.5,7 v65.25,10.75 | U$2.CLK 81,7 78.25,7 78,7 v77.5,7.5
  Bottom 0.254: v65.25,10.75 71.5,10.75 74.75,7.5 v77.5,7.5
  Bottom 0.305: IC3.AOUT 56.33,10.42 56.25,10.5 54.5,10.5 v54.25,10.25
N$6  (2 unrouted)
  Top 0.254: U$1.DOUT 55.34,4 58.5,4 61,6.5 61,10.25 65,14.25 72,14.25 73.25,13 81.25,13 85.5,8.75 85.5,6.97 U$2.DIN
N$7  (via drill 0.35)  (1 unrouted)
  Top 0.254: U$1.DIN 60.5,9.03 60.5,6.75 59,5.25 v58.25,5.25
  Bottom 0.254: v58.25,5.25 57.13,6.37 57.13,7.89 57.63,8.39 IC3.BOUT
N$8
  Top 0.254: IC4.DC 113.25,23.59
  Top 0.305: IC4.IPK 111.89,24.86 113.16,23.59 113.25,23.59 IC4.SC
  Top 0.508: IC4.DC 109.5,22.57 109.5,15.5 | L1.P$1 130.25,9 115.5,9
  pour Top: 109,15.75 112,15.75 112,12.5 116.5,12.5 116.5,8.75 109,8.75
N$9
  Top 0.508: C2.1 113.5,29.35 113.5,26.5 113.86,26.14 IC4.TC
N$10
  Top 0.508: IC4.SE 116.61,24.86 118.75,27 Q1.B 119.87,28.1 D1.A 122.4,28.5 R2.2
N$11  (via drill 0.35)
  Top 0.508: v121.5,22.75 122,23.25 D1.C
  Bottom 0.508: Q1.E 120.71,29.54 121.5,28.75 v121.5,22.75 117.74,18.99 Q2.1
N$12
  Top 0.508: D2.A 128.5,18.5 | 115.36,16.49 114.36,17.49 Q2.2
  Top 2: 128.5,18.5 132.75,14.25 L1.P$2 120.36,11.5 115.36,16.49
N$13  (via drill 0.35)
  Top 0.508: IC4.CII 110.53,28.66 111.85,29.98 C1.1 119.5,32 120.5,31 v121,31 R1.2 | R4.1 129.5,21 131,22.5 131,24 v130,25 130,25.25 129.25,26 R3.2
  Bottom 0.508: v121,31 124,31 v130,25
N$14
  Bottom 0.305: IC1.14 20.2,16.55 21.5,15.25 21.5,13.75 21.75,13.5 28.5,13.5 32.5,9.5 36.75,9.5 43.25,16 49.5,16 53.5,12 59.58,12 | R18.1 61,13.4 59.6,12 59.58,12 | 59.58,12 IC3.CIN
N$15
  Bottom 0.305: IC1.13 21,16.5 21.75,15.75 24,15.75 24.35,15.4 R17.2 24.35,15.5 24.6,15.75 25.6,15.75 27.35,14 28.75,14 30.75,12 38.5,12 43,16.5 62.25,16.5 63,15.75 63,5 61.65,3.65 IC3.DIN
N$16  (via drill 0.35)  (2 unrouted)
  Top 0.254: U$1.LE 60,8.39 60,7.25 v59.25,6.5 | U$2.LE 84.96,7.57 84.96,8.54 81,12.5 73,12.5 72.25,11.75 63.5,11.75 62,10.25 v62,9.25
  Bottom 0.254: IC3.COUT 58.93,8.14 59.43,7.64 59.43,6.68 v59.25,6.5 60.25,6.5 62,8.25 v62,9.25
N$17  (via drill 0.35)  (2 unrouted)
  Top 0.254: U$1.BL 60.77,11.02 v64,14.25 | U$2.BL 86.25,6.59 86.25,8.75 81.5,13.5 74.25,13.5 v73.5,14.25
  Bottom 0.254: v64,14.25 v73.5,14.25
  Bottom 0.305: IC3.DOUT 59.58,2.42 59.75,2.25 61,2.25 63.5,4.75 63.5,13.75 v64,14.25
N$18
  Bottom 0.305: C3.1 15.25,25.25 15.75,24.75 15.75,22.25 16.23,21.77 IC1.20
N$19
  Bottom 0.305: T1.E 17.75,29 17.85,28.9 R10.2 18.6,28.3 IC1.25
N$20
  Top 0.508: R3.1 RX.1
N$21  (1 unrouted)
  Bottom 0.305: R14.2 R13.2 81,24.35 S2.1
N$22  (1 unrouted)
  Bottom 0.305: R11.2 R12.2 97.5,24.5 S1.1
N$23
  Bottom 0.305: R14.1 C8.1 73.36,19.51 67.04,19.51 65.03,17.5 42.5,17.5 42,17 32.75,17 30.75,15 27.75,15 26,16.75 23.75,16.75 23.4,17.1 IC1.10
N$24
  Bottom 0.305: R12.1 C7.1 93.1,20.4 91.5,22 83,22 78,17 42.75,17 40.25,14.5 27.5,14.5 25.75,16.25 23.25,16.25 22.6,16.9 IC1.11
N$25  (1 unrouted)
  Bottom 0.305: R16.2 R15.2 49,24.85 S3.1
N$26
  Bottom 0.305: R16.1 C9.1 40.65,20.4 39.88,19.62 32.38,19.62 31.25,18.5 31.25,16.25 30.5,15.5 28,15.5 25.52,17.98 IC1.9
RST
  Bottom 0.305: IC1.29 21.8,27.3 22.25,27.75 23.6,27.75 R7.1 27.65,26 29.76,26 32.71,23.06 36.31,23.06 41,27.75 41,30.25 41.75,31 43.75,31 47.52,27.23 ICSP.5
SCK  (via drill 0.35)
  Top 0.305: v31.75,4.5 28.25,8 28.25,13 25.25,16 18.5,16 v17,17.5 | v49.25,13.75 52.5,17 52.5,20.25 58.81,26.56 ICSP.3
  Bottom 0.305: IC1.17 17.2,17.7 v17,17.5 | v31.75,4.5 31.83,4.58 36.96,4.58 38,5.62 38,9.25 43.75,15 48,15 v49.25,13.75 52,11 56.5,11 56.98,10.52 IC3.AIN
SCL  (via drill 0.35)
  Top 0.305: v30,10 29.25,10.75 29.25,13.5 25.75,17 22.25,17 21,18.25 v21,24.5
  Bottom 0.305: R8.1 21,27.4 IC1.28 v21,24.5 | RTC.16 40.67,11.17 38.5,9 38.5,3.25 37,1.75 32.25,1.75 30.5,3.5 30.5,9.5 v30,10
SDA  (via drill 0.35)
  Top 0.305: v29.5,8.75 28.75,9.5 28.75,13.25 25.5,16.5 22,16.5 19.75,18.75 v19.75,24.5
  Bottom 0.305: R9.1 20.2,28.85 IC1.27 20.2,24.95 v19.75,24.5 | RTC.15 40.15,9.9 39,8.75 39,3 37.25,1.25 32,1.25 30,3.25 30,8.25 v29.5,8.75
VCC  (via drill 0.35)  (3 unrouted)
  Top 0.508: v62.75,18.5 62.75,14.25 61.75,13.25 55.5,13.25 | 55.5,13.25 53.5,15.25 v52.75,15.25 | 55.5,13.25 55.5,13 v52.5,10
  Bottom 0.305: 17.1,20.27 IC1.18 | C10.1 12.65,20.1 | IC1.18 15.93,20.18 15.25,19.5 13.25,19.5 12.65,18.9 C11.1 C10.1 | 21.73,20.98 19,20.98 18.2,20.18 IC1.18 | 21.73,20.98 IC1.6 27.38,20.98 C6.1 28.15,22.65 28.5,23 28.15,23.35 C4.1 26.65,22.5 25.67,22.5 IC1.4 23.32,22.57 21.73,20.98 | R7.2 R8.2 R9.2 20.25,31.25 19.5,32 14.25,32 12.25,30 12.25,29.02 T1.C 11,27.77 11,23.75 11.75,23 C5.1 C10.1 | R19.2 C15.1 C14.1 R18.2 | RTC.2 52.4,9.9 v52.5,10 53,9.5 55.68,9.5 IC3.VCC
  Bottom 0.508: S3.3 52,32.5 59.87,32.5 61.35,31.02 | 61.35,31.02 ICSP.2 63.5,27.62 63.5,19.25 v62.75,18.5 | 61.35,31.02 62.98,32.65 71.35,32.65 S2.4 | S2.3 S1.4 | S3.4 42.5,28.25 36.75,22.5 31.75,22.5 31.25,23 28.5,23 | v52.75,15.25 52.85,15.35 R19.2
  Bottom 0.762: IC2.3 10.75,6.84 10.75,14.1 C13.1 C11.1